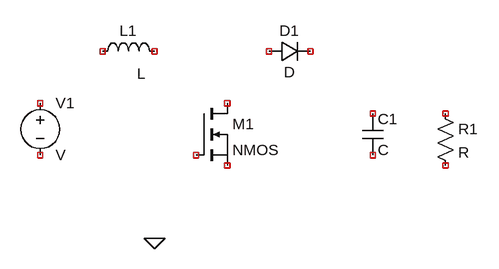
[diagram p0: schematic proj_schematic.asc]
proj_schematic.asc, the LTspice schematic file:
Version 4
SHEET 1 880 680
FLAG 112 176 0
SYMBOL ind 16 -96 R270
WINDOW 0 32 56 VTop 2
WINDOW 3 -3 76 VBottom 2
SYMATTR InstName L1
SYMBOL res 544 -32 R0
SYMATTR InstName R1
SYMBOL cap 432 -16 R0
SYMATTR InstName C1
SYMBOL voltage -64 -48 R0
SYMATTR InstName V1
SYMBOL diode 288 -96 R270
WINDOW 0 32 32 VTop 2
WINDOW 3 0 32 VBottom 2
SYMATTR InstName D1
SYMBOL nmos 176 -32 R0
SYMATTR InstName M1

The netlist it stands for:
* proj_schematic.asc
L1 NC_01 NC_02 L
R1 NC_03 NC_04 R
C1 NC_05 NC_06 C
V1 NC_07 NC_08 V
D1 NC_09 NC_10 D
M1 NC_11 NC_12 NC_13 NC_13 NMOS
.model D D
.lib standard.dio
.model NMOS NMOS
.model PMOS PMOS
.lib standard.mos
.backanno
.end